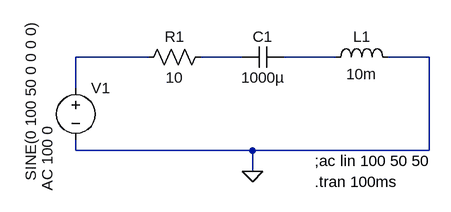
[diagram p0: schematic RLC Circuits (3) - Resistive Circuit.asc]
RLC Circuits (3) - Resistive Circuit.asc, the LTspice schematic file:
Version 4
SHEET 1 880 680
WIRE 0 96 -112 96
WIRE 144 96 80 96
WIRE 288 96 208 96
WIRE 432 96 368 96
WIRE -112 144 -112 96
WIRE -112 240 -112 224
WIRE 160 240 -112 240
WIRE 432 240 432 96
WIRE 432 240 160 240
WIRE 160 272 160 240
FLAG 160 272 0
SYMBOL voltage -112 128 R0
WINDOW 3 -69 -88 VRight 2
WINDOW 123 -44 74 VRight 2
WINDOW 39 0 0 Left 0
SYMATTR InstName V1
SYMATTR Value SINE(0 100 50 0 0 0 0)
SYMATTR Value2 AC 100 0
SYMBOL res 96 80 R90
WINDOW 0 0 56 VBottom 2
WINDOW 3 32 56 VTop 2
SYMATTR InstName R1
SYMATTR Value 10
SYMBOL cap 208 80 R90
WINDOW 0 0 32 VBottom 2
WINDOW 3 32 32 VTop 2
SYMATTR InstName C1
SYMATTR Value 1000µ
SYMBOL ind 272 112 R270
WINDOW 0 32 56 VTop 2
WINDOW 3 5 56 VBottom 2
SYMATTR InstName L1
SYMATTR Value 10m
TEXT 256 256 Left 2 !;ac lin 100 50 50
TEXT 256 288 Left 2 !.tran 100ms

The netlist it stands for:
* RLC Circuits (3) - Resistive Circuit.asc
V1 N001 0 SINE(0 100 50 0 0 0 0) AC 100 0
R1 N002 N001 10
C1 N003 N002 1000µ
L1 N003 0 10m
;ac lin 100 50 50
.tran 100ms
.backanno
.end